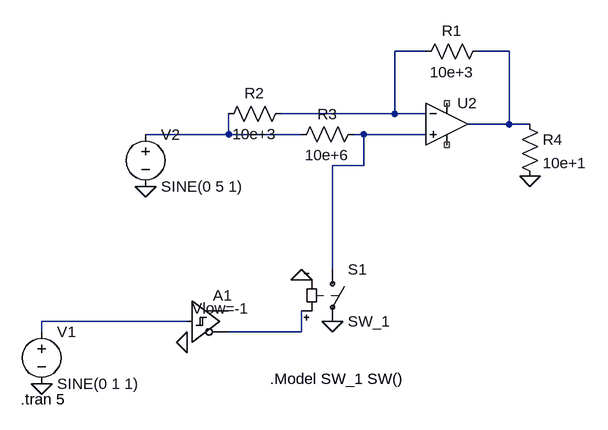
[diagram p0: schematic synchronous_detector.asc]
synchronous_detector.asc, the LTspice schematic file:
Version 4
SHEET 1 880 680
WIRE 368 -176 320 -176
WIRE 496 -176 448 -176
WIRE 320 -80 320 -176
WIRE 320 -80 144 -80
WIRE 368 -80 320 -80
WIRE 496 -64 496 -176
WIRE 496 -64 432 -64
WIRE 528 -64 496 -64
WIRE 64 -48 64 -80
WIRE 64 -48 -64 -48
WIRE 176 -48 64 -48
WIRE 272 -48 256 -48
WIRE 368 -48 272 -48
WIRE 272 0 272 -48
WIRE 272 0 224 0
WIRE 224 160 224 0
WIRE 0 240 -224 240
WIRE -224 256 -224 240
WIRE 176 256 176 224
WIRE 176 256 64 256
FLAG -224 336 0
FLAG 176 176 0
FLAG 224 240 0
FLAG 528 16 0
FLAG -64 32 0
FLAG 0 272 0
SYMBOL voltage -224 240 R0
WINDOW 123 0 0 Left 0
WINDOW 39 0 0 Left 0
SYMATTR InstName V1
SYMATTR Value SINE(0 1 1)
SYMBOL sw 224 144 R0
SYMATTR InstName S1
SYMATTR Value SW_1
SYMBOL OpAmps\\UniversalOpAmp1 400 -64 R0
SYMATTR InstName U2
SYMBOL res 464 -192 R90
WINDOW 0 0 56 VBottom 2
WINDOW 3 32 56 VTop 2
SYMATTR InstName R1
SYMATTR Value 10e+3
SYMBOL res 160 -96 R90
WINDOW 0 0 56 VBottom 2
WINDOW 3 32 56 VTop 2
SYMATTR InstName R2
SYMATTR Value 10e+3
SYMBOL res 272 -64 R90
WINDOW 0 0 56 VBottom 2
WINDOW 3 32 56 VTop 2
SYMATTR InstName R3
SYMATTR Value 10e+6
SYMBOL res 512 -80 R0
SYMATTR InstName R4
SYMATTR Value 10e+1
SYMBOL voltage -64 -64 R0
WINDOW 123 0 0 Left 0
WINDOW 39 0 0 Left 0
SYMATTR InstName V2
SYMATTR Value SINE(0 5 1)
SYMBOL Digital\\schmitt 0 176 R0
WINDOW 3 8 44 Left 2
SYMATTR InstName A1
SYMATTR Value Vlow=-1
TEXT 128 328 Left 2 !.Model SW_1 SW()
TEXT -256 360 Left 2 !.tran 5

The netlist it stands for:
* synchronous_detector.asc
V1 N005 0 SINE(0 1 1)
S1 N004 0 N006 0 SW_1
XU2 N004 N001 NC_01 NC_02 N002 level1 Avol=1Meg GBW=10Meg Vos=0 En=0 Enk=0 In=0 Ink=0 Rin=500Meg  ; pins In+ In- V+ V- OUT
R1 N002 N001 10e+3
R2 N001 N003 10e+3
R3 N004 N003 10e+6
R4 N002 0 10e+1
V2 N003 0 SINE(0 5 1)
A1 N005 0 0 0 0 N006 0 0 SCHMITT Vlow=-1
.Model SW_1 SW()
.tran 5
.lib UniversalOpAmp1.lib
.backanno
.end